# EAGLE design ISP_Pogo_Board (EAGLE 6.3)
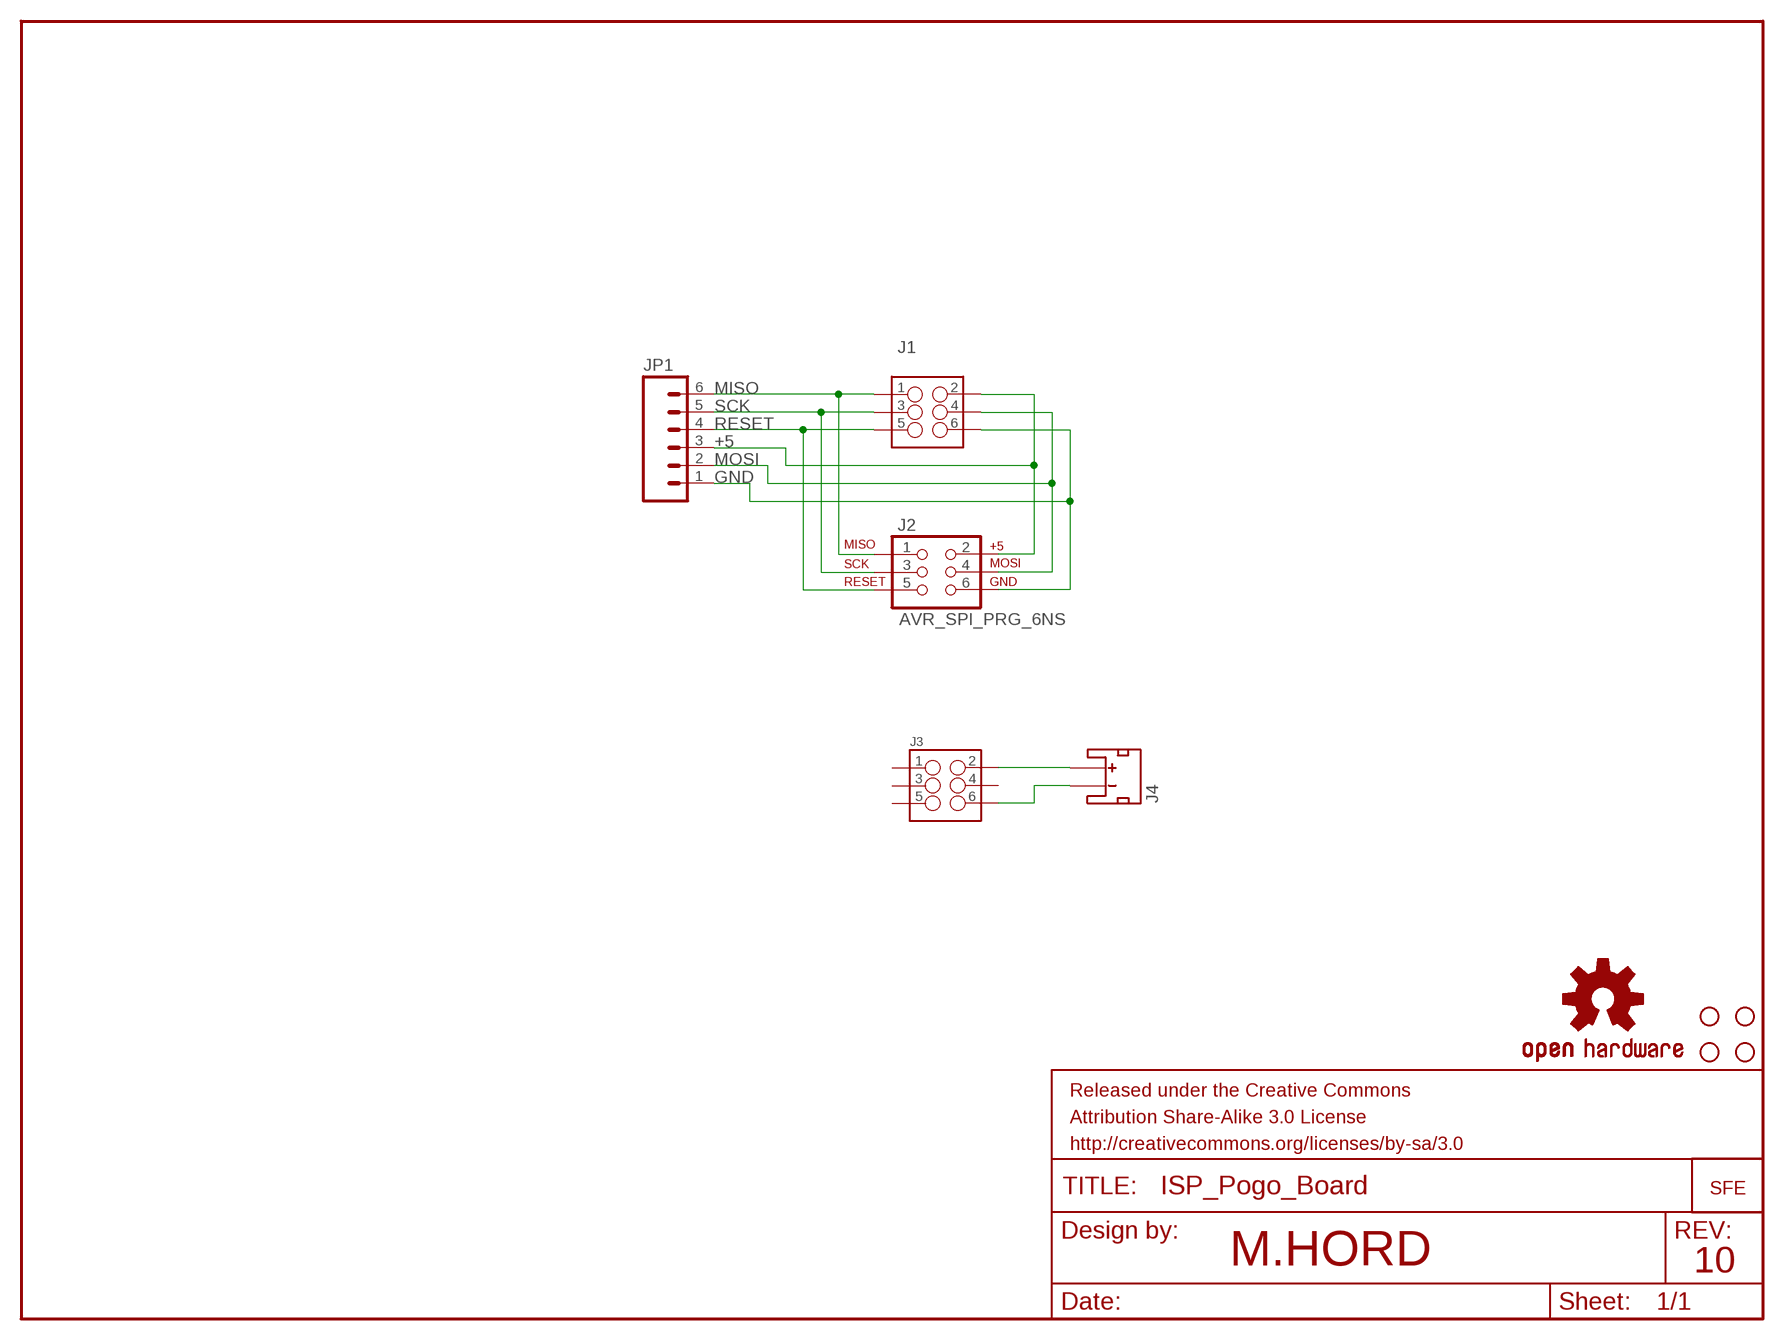
[diagram p0: schematic, sheet 1]

## Parts
FRAME1  FRAME-LETTER  [CREATIVE_COMMONS]
J1  M03X2POGO_PINS  [2X3_POGO]
J2  AVR_SPI_PRG_6NS  [2X3-NS]
J3  M03X2POGO_PINS  [2X3_POGO]
J4  JST_2MM_MALE  [JST-2-SMD]
JP1  M06POLAR  [MOLEX-1X6]
JP2  STAND-OFF  [STAND-OFF]
JP3  STAND-OFF  [STAND-OFF]
JP4  STAND-OFF  [STAND-OFF]
JP5  STAND-OFF  [STAND-OFF]
JP6  LOGO-SFENW2  [SFE-NEW-WEB]
U$1  OSHW-LOGOS  [OSHW-LOGO-S]

## Nets
+5: J1.P$2 J2.2 JP1.3
GND: J1.P$6 J2.6 JP1.1
MISO: J1.P$1 J2.1 JP1.6
MOSI: J1.P$4 J2.4 JP1.2
N$1: J3.P$2 J4.2(+)
N$2: J3.P$6 J4.1(-)
RESET: J1.P$5 J2.5 JP1.4
SCK: J1.P$3 J2.3 JP1.5
Unconnected: J3.P$1 J3.P$3 J3.P$4 J3.P$5 J4.NC1(PAD1) J4.NC2(PAD2)

## Notes on the sheet
- M.HORD | 10

## Library data of the parts
FRAME1 = SparkFun-Aesthetics:FRAME-LETTER: Schematic Frame Standard 8.5x11 US Letter frame
J1 J3 = SparkFun-Connectors:M03X2: 2x3 .1" header. Shrouded, with keying- CONN-10681 SMT- CONN-11415 Pogo pins- HW-11044; PROD_ID: HW-11044
J2 = SparkFun-Connectors:AVR_SPI_PRG_6: AVR ISP 6 Pin This is the reduced ISP connector for AVR programming. Common on Arduino. This footprint will take up less PCB space and can be used with a 10-pin to 6-pin adapter such as SKU: BOB-08508
J4 = SparkFun-Connectors:JST_2MM_MALE: Mates to single-cell LiPo batteries. CONN-08352; PROD_ID: CONN-08352
JP1 = SparkFun-Connectors:M06: Header 6 Standard 6-pin 0.1" header. Use with straight break away headers (SKU : PRT-00116), right angle break away headers (PRT-00553), swiss pins (PRT-00743), machine pins (PRT-00117), and female headers (PRT-00115). Molex polarized connector foot print use with SKU : PRT-08094 with associated crimp pins and housings. NOTES ON THE VARIANTS LOCK and LOCK_LONGPADS... This footprint was designed to help hold the alignment of a through-hole component (i.e. 6-pin header) while soldering it into place. You may notice that each hole has been shifted either up or down by 0.005 of an inch from it's more standard position (which is a perfectly straight line). This slight alteration caused the pins (the squares in the middle) to touch the edges of the holes. Because they are alternating, it causes a "brace" to hold the component in place. 0.005 has proven to be the perfect amount of "off-center" position when using our standard breakaway headers. Although looks a little odd when you look at the bare footprint, once you have a header in there, the alteration is very hard to notice. Also, if you push a header all the way into place, it is covered up entirely on the bottom side. This idea of altering the position of holes to aid alignment will be further integrated into the Sparkfun Library for other footprints. It can help hold any component with 3 or more connection pins.
JP2-JP5 = SparkFun-Electromechanical:STAND-OFF: #4 Stand Off This is the mechanical footprint for a #4 phillips button head screw. Use the keepout ring to avoid running the screw head into surrounding components. SKU : PRT-00447
JP6 = SparkFun-Aesthetics:LOGO-SFE: Spark Fun Electronics PCB Logo This is the standard Spark Fun Electronics PCB logo.
U$1 = SparkFun-Aesthetics:OSHW-LOGO: Open Source Hardware Logo This logo indicates the piece of hardware it is found on incorporates a OSHW license and/or adheres to the definition of open source hardware found here: http://freedomdefined.org/OSHW

## Board
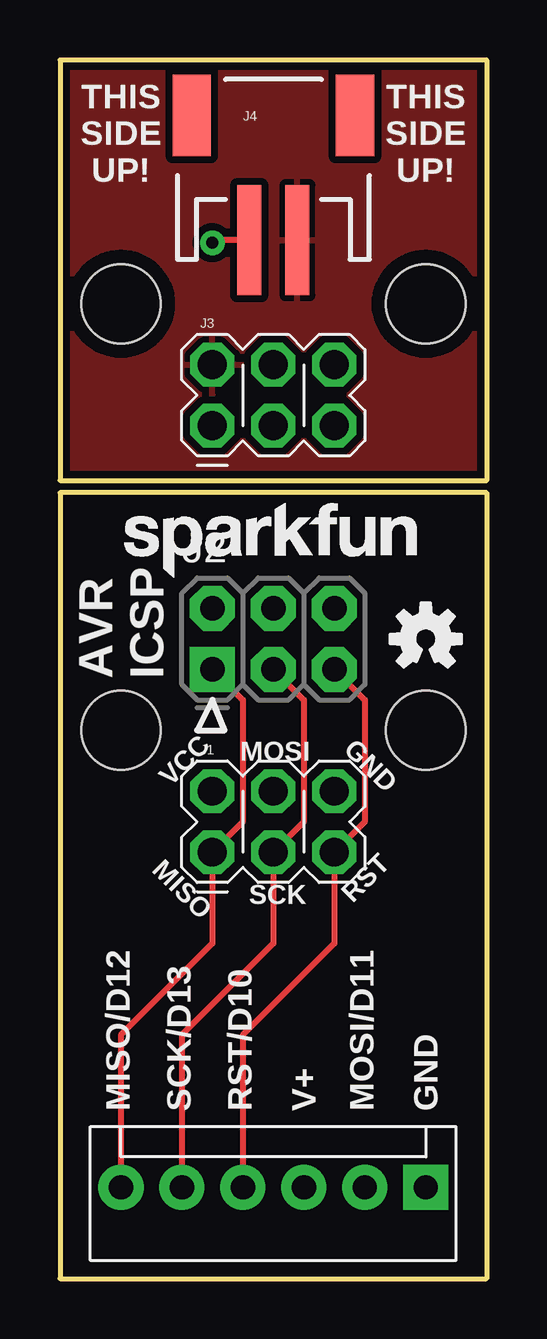
[diagram p1: board, top side]
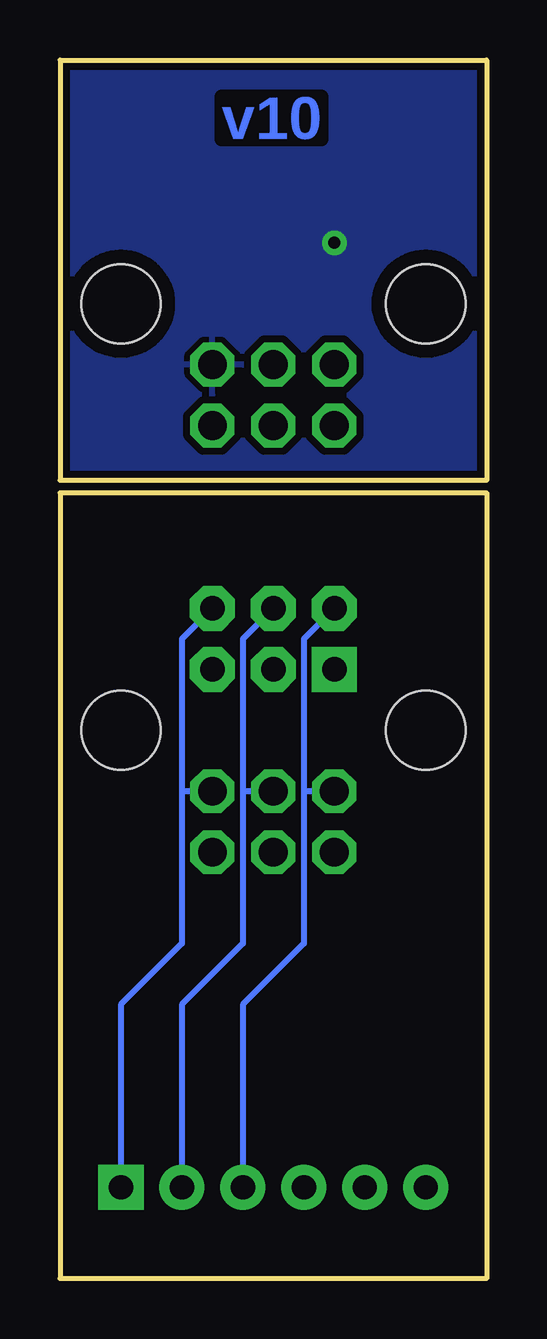
[diagram p2: board, bottom side, seen from below]

Size 17.78 x 50.8 mm. Coordinates in mm from the lower left corner, seen from the top.
Outline: 17.76,0 0,0 0,32.77 17.78,32.77 17.78,0
Outline: 17.78,50.8 0,50.8 0,33.27 17.78,33.27 17.78,50.8
Copper layers (1*16): Top 0.035mm / dielectric 1.5mm / Bottom 0.035mm
Design rules "Sparkfun": minimum track width 8mil, minimum drill 20mil, track to track 8mil, track to pad 8mil, pad to pad 8mil, via to via 8mil, smd to smd 8mil, copper to edge 8mil, drill to drill 8mil, minimum pad ring 12mil, minimum via ring 10mil, stop-mask expansion 4mil, vias tented up to drill 20mil, thermal gap 10mil

### Footprints (pad centres in the part's own frame; a part is rotated, then mirrored left to right if it is on the bottom)
2X3_POGO = drill 1.2 pad 1.829 octagon: P$1 0,0; P$2 0,2.54; P$3 2.54,0; P$4 2.54,2.54; P$5 5.08,0; P$6 5.08,2.54
2X3-NS = drill 1.016 pad 1.88 square: 1 -2.54,-1.27 | drill 1.016 pad 1.88 octagon: 2 -2.54,1.27; 3 0,-1.27; 4 0,1.27; 5 2.54,-1.27; 6 2.54,1.27
JST-2-SMD = smd 1 x 4.6: 1 -1,-3.7; 2 1,-3.7 | smd 1.6 x 3.4: NC1 -3.4,1.5; NC2 3.4,1.5
MOLEX-1X6 = drill 1.016 pad 1.88 square: 1 0,0 | drill 1.016 pad 1.88: 2 2.54,0; 3 5.08,0; 4 7.62,0; 5 10.16,0; 6 12.7,0
STAND-OFF = hole 3.302: 0,0

### Placement (x,y rotation side)
FRAME1  -66.04,-10.16 0 top  (outside the outline)
J1  6.35,17.78 0 top
J2  8.89,26.67 0 top
J3  6.35,35.56 0 top
J4  8.89,46.99 0 top
JP1  15.24,3.81 180 top
JP2  15.24,22.86 0 top
JP3  2.54,22.86 0 top
JP4  2.54,40.64 0 top
JP5  15.24,40.64 0 top
JP6  2.67,29.21 0 top
U$1  15.24,26.67 0 top

### Tracks (layer width: path | path; a pad name or v marks a point on that pad's centre or on a via)
+5
  Bottom 0.254: J2.2 7.62,26.67 7.62,20.32 | 7.62,20.32 7.62,13.97 10.16,11.43 JP1.3 | J1.P$2 7.62,20.32
GND
  Bottom 0.254: J2.6 12.7,26.67 12.7,20.32 | 12.7,20.32 12.7,13.97 15.24,11.43 JP1.1 | J1.P$6 12.7,20.32
MISO
  Top 0.254: J2.1 7.62,24.13 7.62,19.05 J1.P$1 6.35,13.97 2.54,10.16 JP1.6
MOSI
  Bottom 0.254: J2.4 10.16,26.67 10.16,20.32 | 10.16,20.32 10.16,13.97 12.7,11.43 JP1.2 | J1.P$4 10.16,20.32
N$1
  pour Top (isolate 0.305): 0,50.8 17.78,50.8 17.78,33.27 0,33.27
N$2  (via drill 0.51)
  Top 0.254: J4.1 6.46,43.29 v6.35,43.18
  pour Bottom (isolate 0.305): 0,50.8 17.78,50.8 17.78,33.27 0,33.27
RESET
  Top 0.254: J2.5 12.7,24.13 12.7,19.05 J1.P$5 11.43,13.97 7.62,10.16 JP1.4
SCK
  Top 0.254: J2.3 10.16,24.13 10.16,19.05 J1.P$3 8.89,13.97 5.08,10.16 JP1.5

### Text on the board
Bottom: v10
tPlace: THIS / SIDE / UP! | THIS / SIDE / UP! | AVR / ICSP | MOSI | GND | VCC | MISO | SCK | RST | MISO/D12 | SCK/D13 | RST/D10 | V+ | MOSI/D11 | GND
tValues: M.HORD